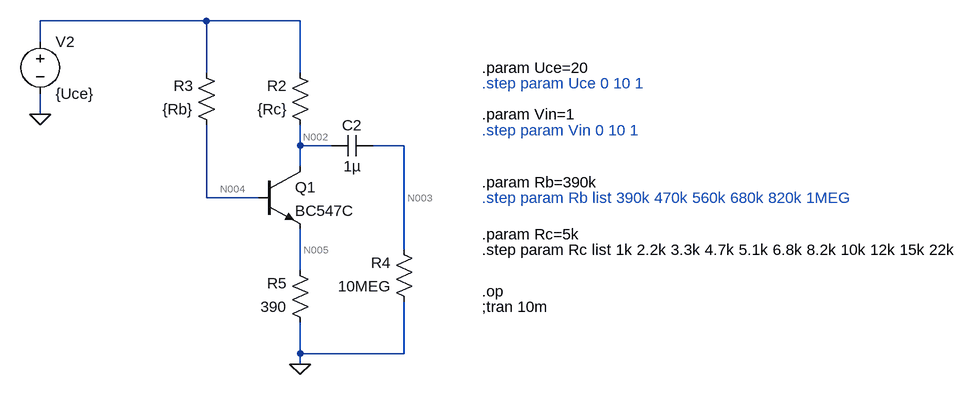
[diagram p0: schematic 5_amplifier-bias.asc]
5_amplifier-bias.asc, the LTspice schematic file:
Version 4
SHEET 1 1672 680
WIRE 400 -224 144 -224
WIRE 544 -224 400 -224
WIRE 144 -192 144 -224
WIRE 400 -144 400 -224
WIRE 544 -144 544 -224
WIRE 144 -80 144 -112
WIRE 544 -32 544 -64
WIRE 592 -32 544 -32
WIRE 704 -32 656 -32
WIRE 544 0 544 -32
WIRE 400 48 400 -64
WIRE 480 48 400 48
WIRE 704 128 704 -32
WIRE 544 160 544 96
WIRE 544 288 544 240
WIRE 704 288 704 208
WIRE 704 288 544 288
WIRE 544 304 544 288
FLAG 544 304 0
FLAG 144 -80 0
SYMBOL npn3 480 0 R0
SYMATTR InstName Q1
SYMATTR Value BC547C
SYMBOL res 560 -48 R180
WINDOW 0 36 76 Left 2
WINDOW 3 36 40 Left 2
SYMATTR InstName R2
SYMATTR Value {Rc}
SYMBOL voltage 144 -208 R0
WINDOW 123 0 0 Left 2
WINDOW 39 0 0 Left 2
SYMATTR InstName V2
SYMATTR Value {Uce}
SYMBOL res 416 -48 R180
WINDOW 0 36 76 Left 2
WINDOW 3 36 40 Left 2
SYMATTR InstName R3
SYMATTR Value {Rb}
SYMBOL cap 656 -48 R90
WINDOW 0 0 32 VBottom 2
WINDOW 3 32 32 VTop 2
SYMATTR InstName C2
SYMATTR Value 1µ
SYMBOL res 720 224 R180
WINDOW 0 36 76 Left 2
WINDOW 3 36 40 Left 2
SYMATTR InstName R4
SYMATTR Value 10MEG
SYMBOL res 560 256 R180
WINDOW 0 36 76 Left 2
WINDOW 3 36 40 Left 2
SYMATTR InstName R5
SYMATTR Value 390
TEXT 824 192 Left 2 !.op
TEXT 824 -128 Left 2 ;.step param Uce 0 10 1
TEXT 824 216 Left 2 !;tran 10m
TEXT 824 -152 Left 2 !.param Uce=20
TEXT 824 -56 Left 2 ;.step param Vin 0 10 1
TEXT 824 48 Left 2 ;.step param Rb list 390k 470k 560k 680k 820k 1MEG
TEXT 824 -80 Left 2 !.param Vin=1
TEXT 824 104 Left 2 !.param Rc=5k
TEXT 824 128 Left 2 !.step param Rc list 1k 2.2k 3.3k 4.7k 5.1k 6.8k 8.2k 10k 12k 15k 22k
TEXT 824 24 Left 2 !.param Rb=390k

The netlist it stands for:
* 5_amplifier-bias.asc
Q1 N002 N004 N005 0 BC547C
R2 N002 N001 {Rc}
V2 N001 0 {Uce}
R3 N004 N001 {Rb}
C2 N003 N002 1µ
R4 0 N003 10MEG
R5 0 N005 390
.model NPN NPN
.model PNP PNP
.lib standard.bjt
.op
* .step param Uce 0 10 1
;tran 10m
.param Uce=20
* .step param Vin 0 10 1
* .step param Rb list 390k 470k 560k 680k 820k 1MEG
.param Vin=1
.param Rc=5k
.step param Rc list 1k 2.2k 3.3k 4.7k 5.1k 6.8k 8.2k 10k 12k 15k 22k
.param Rb=390k
.backanno
.end

* Results of the author's LTspice run, read from the files saved beside the schematic
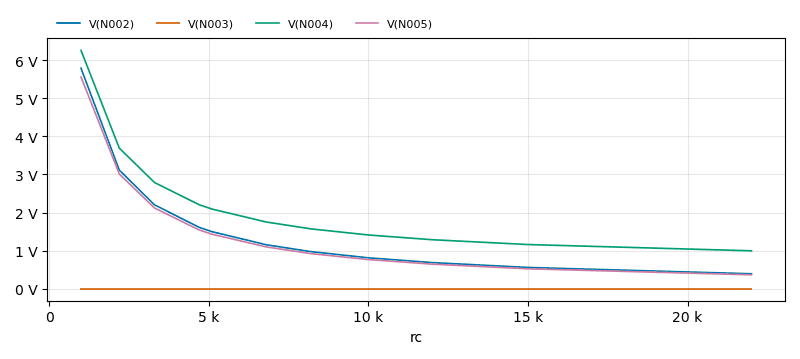
[diagram p1: Operating Point of 5_amplifier-bias.asc, plotted from the saved traces]
* Operating Point, 1 run:
*   V(N002): 5.787 V at rc=1 k, 394.5 mV at rc=22 k, min 394.5 mV, max 5.787 V
*   V(N003): 57.87 pV at rc=1 k, 3.945 pV at rc=22 k, min 3.945 pV, max 57.87 pV
*   V(N004): 6.254 V at rc=1 k, 996.2 mV at rc=22 k, min 996.2 mV, max 6.254 V
*   V(N005): 5.557 V at rc=1 k, 366.6 mV at rc=22 k, min 366.6 mV, max 5.557 V
* From the log:
*   Semiconductor Device Operating Points:
*                           --- Bipolar Transistors ---
*   Name:       q1
*   Model:    bc547c
*   Ib:       3.52e-05
*   Ic:       1.42e-02
*   Vbe:      6.97e-01
*   Vbc:      4.67e-01
*   Vce:      2.30e-01
*   BetaDC:   4.03e+02
*   Gm:       4.97e-01
*   Rpi:      7.54e+02
*   Rx:       1.00e+00
*   Ro:       2.35e+03
*   Cbe:      3.11e-10
*   Cbc:      1.35e-11
*   Cjs:      0.00e+00
*   BetaAC:   3.74e+02
*   Cbx:      8.32e-12
*   Ft:       2.38e+08